# EAGLE design PoE_Mag-revD (EAGLE 8.6.0)
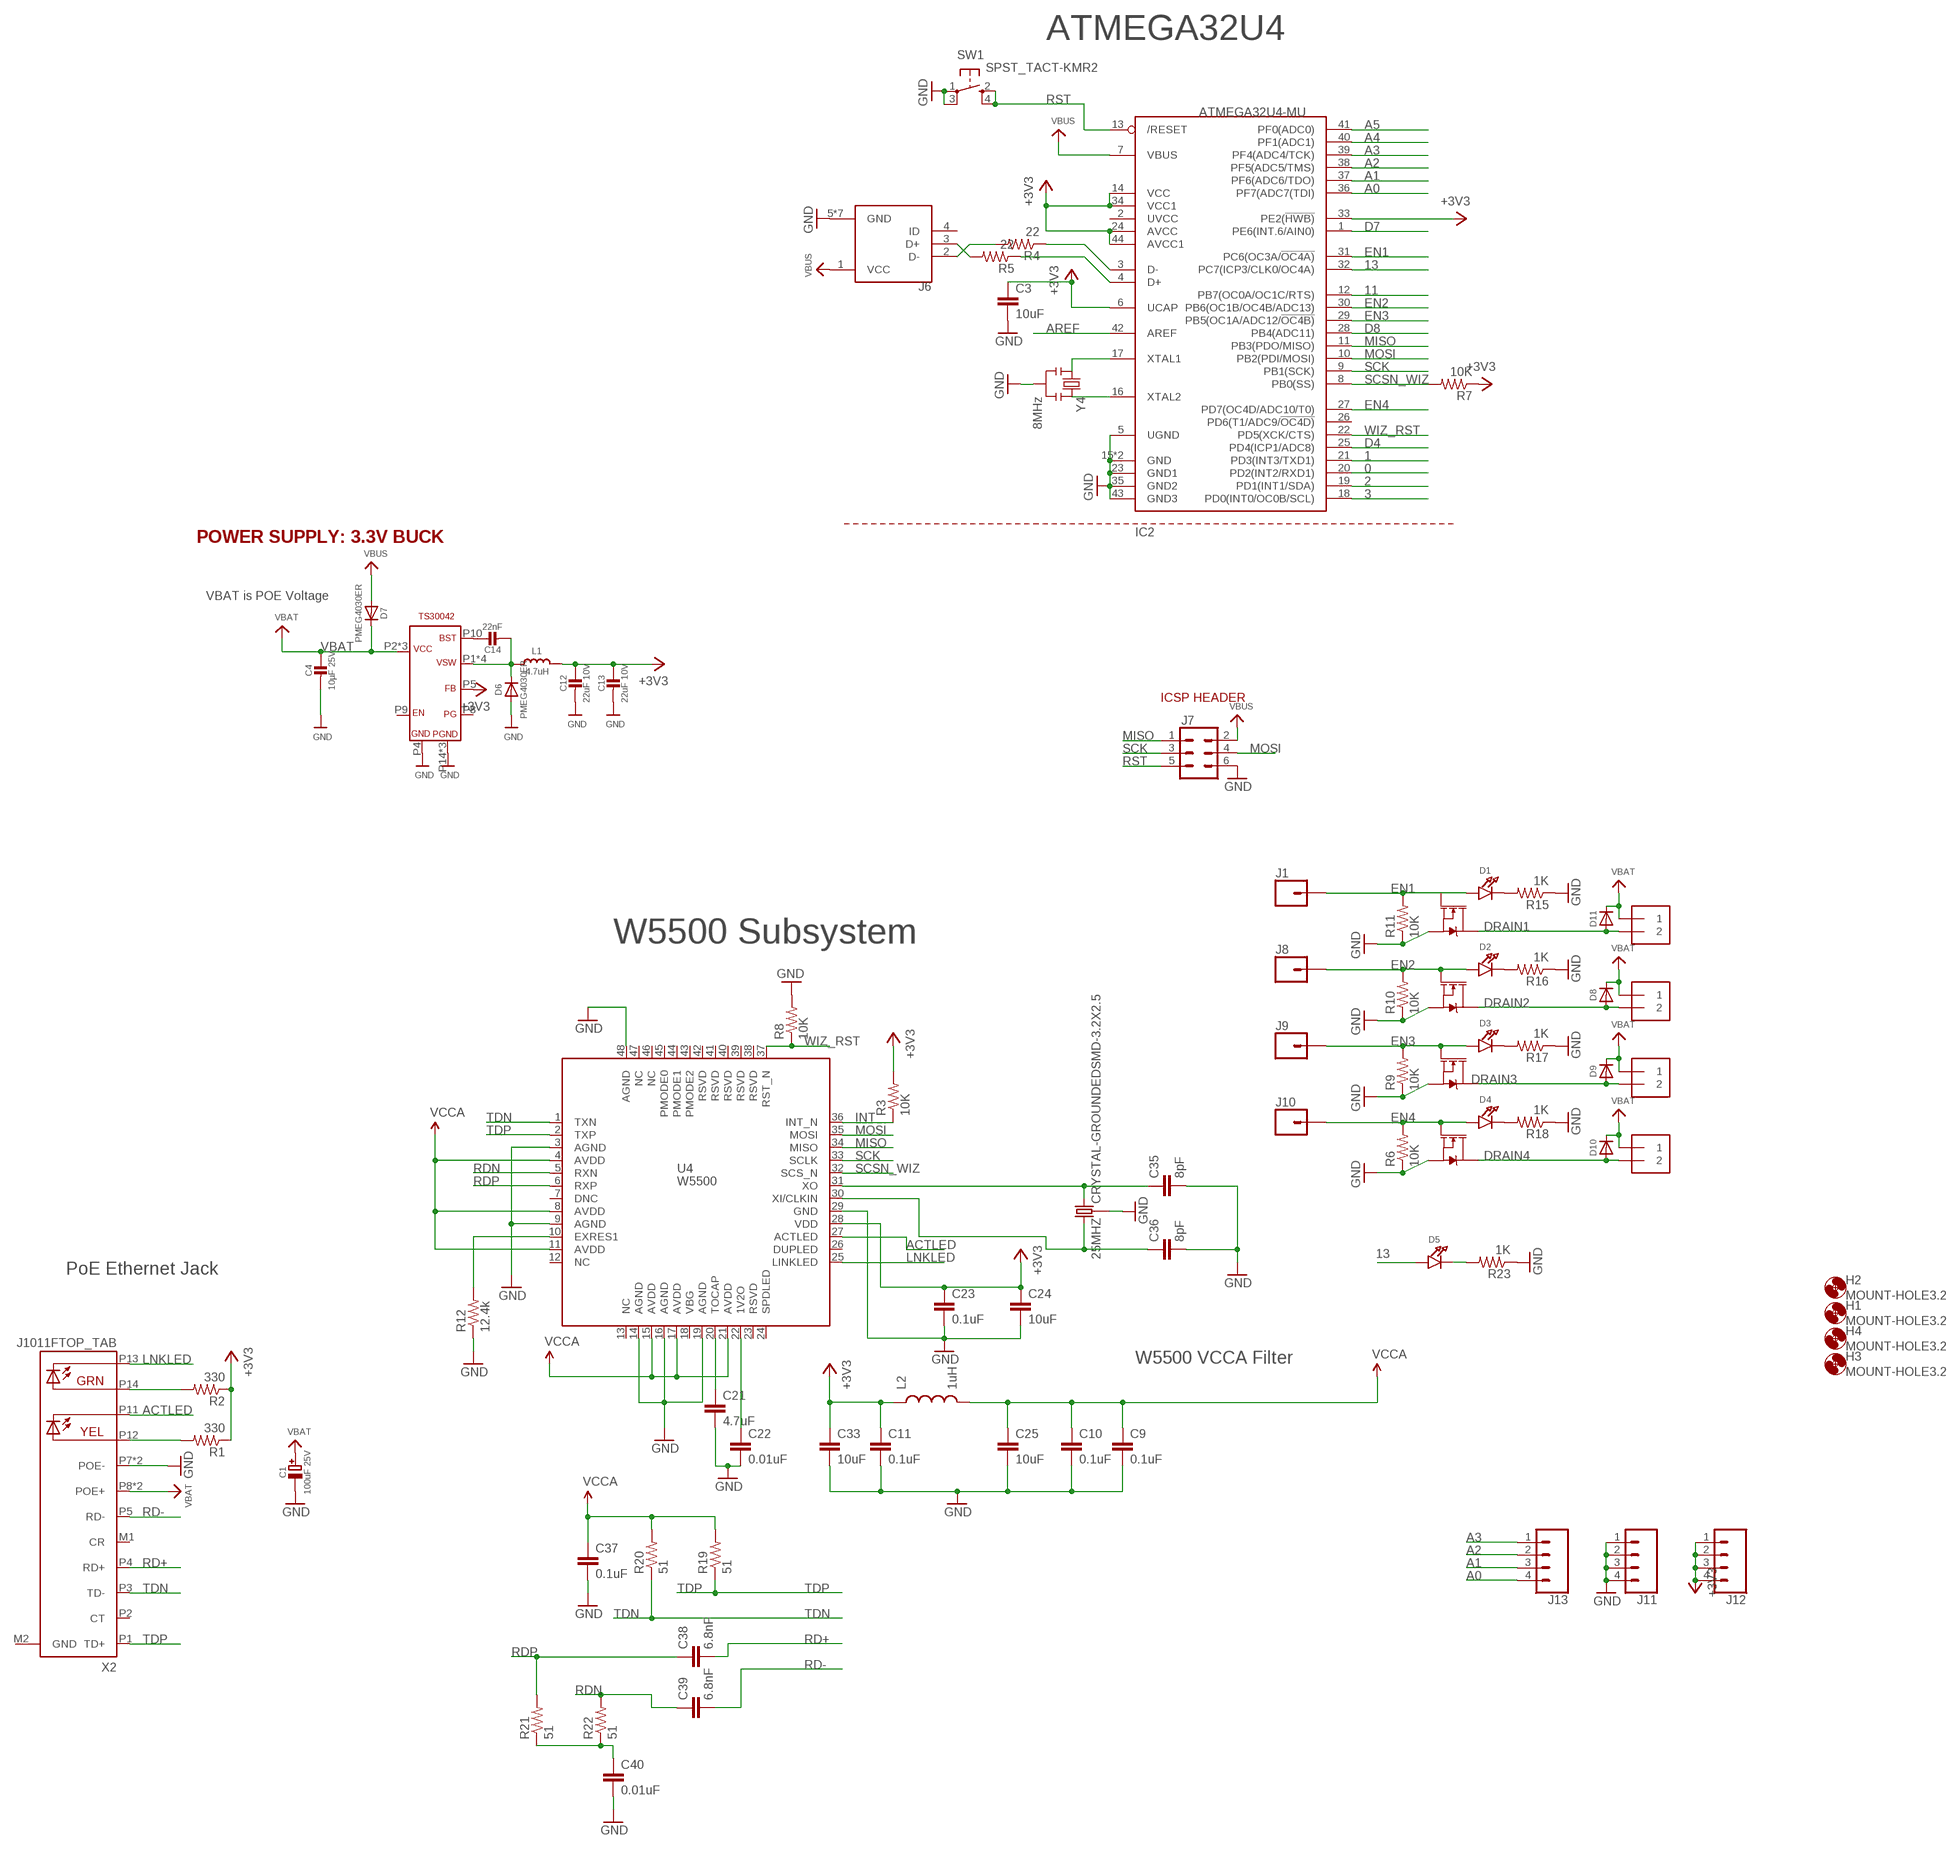
[diagram p0: schematic, sheet 1]

## Parts
25MHZ  CRYSTAL-GROUNDEDSMD-3.2X2.5  [CRYSTAL-SMD-3.2X2.5MM]
C1  100uF 25V  CAP_ELECTROLYTICPANASONIC_D  [PANASONIC_D]
C3  10uF  CAP0603-CAP  [0603-CAP]
C4  10µF 25V  CAP_CERAMIC0603MINI  [0603-MINI]
C9  0.1uF  CAP0603-CAP  [0603-CAP]
C10  0.1uF  CAP0603-CAP  [0603-CAP]
C11  0.1uF  CAP0603-CAP  [0603-CAP]
C12  22uF 10V  CAP_CERAMIC0603MINI  [0603-MINI]
C13  22uF 10V  CAP_CERAMIC0603MINI  [0603-MINI]
C14  22nF  CAP_CERAMIC0603MINI  [0603-MINI]
C21  4.7uF  CAP0603-CAP  [0603-CAP]
C22  0.01uF  CAP0603-CAP  [0603-CAP]
C23  0.1uF  CAP0603-CAP  [0603-CAP]
C24  10uF  CAP0603-CAP  [0603-CAP]
C25  10uF  CAP0603-CAP  [0603-CAP]
C33  10uF  CAP0603-CAP  [0603-CAP]
C35  8pF  CAP0603-CAP  [0603-CAP]
C36  8pF  CAP0603-CAP  [0603-CAP]
C37  0.1uF  CAP0603-CAP  [0603-CAP]
C38  6.8nF  CAP0603-CAP  [0603-CAP]
C39  6.8nF  CAP0603-CAP  [0603-CAP]
C40  0.01uF  CAP0603-CAP  [0603-CAP]
D1  LED0805_NOOUTLINE  [CHIPLED_0805_NOOUTLINE]
D2  LED0805_NOOUTLINE  [CHIPLED_0805_NOOUTLINE]
D3  LED0805_NOOUTLINE  [CHIPLED_0805_NOOUTLINE]
D4  LED0805_NOOUTLINE  [CHIPLED_0805_NOOUTLINE]
D5  LED0805_NOOUTLINE  [CHIPLED_0805_NOOUTLINE]
D6  PMEG4030ER  DIODESOD-123  [SOD-123]
D7  PMEG4030ER  DIODESOD-123  [SOD-123]
D8  DIODESOD-123  [SOD-123]
D9  DIODESOD-123  [SOD-123]
D10  DIODESOD-123  [SOD-123]
D11  DIODESOD-123  [SOD-123]
H1  MOUNT-HOLE3.2  [3,2]
H2  MOUNT-HOLE3.2  [3,2]
H3  MOUNT-HOLE3.2  [3,2]
H4  MOUNT-HOLE3.2  [3,2]
IC2  ATMEGA32U4-MU  [TQFN44_7MM]
J1  CONN_01  [1X01]
J2  1X2-3.5MM  [1X2-3.5MM]
J3  1X2-3.5MM  [1X2-3.5MM]
J4  1X2-3.5MM  [1X2-3.5MM]
J5  1X2-3.5MM  [1X2-3.5MM]
J6  10103594-0001LF  [FCI_10103594-0001LF]
J7  CONN_03X2NO_SILK  [2X3-NS]
J8  CONN_01  [1X01]
J9  CONN_01  [1X01]
J10  CONN_01  [1X01]
J11  CONN_04  [1X04]
J12  CONN_04  [1X04]
J13  CONN_041X04_NO_SILK  [1X04_NO_SILK]
L1  4.7uH  INDUCTORTDK_VLC5045  [INDUCTOR_5X5MM_TDK_VLC5045]
L2  1uH  INDUCTOR0603  [0603]
Q1  35A/25V/8.5mΩ  MOSFET-NCH-FDD8780  [DPAK]
Q3  35A/25V/8.5mΩ  MOSFET-NCH-FDD8780  [DPAK]
Q5  35A/25V/8.5mΩ  MOSFET-NCH-FDD8780  [DPAK]
Q6  35A/25V/8.5mΩ  MOSFET-NCH-FDD8780  [DPAK]
R1  330  RESISTOR0603-RES  [0603-RES]
R2  330  RESISTOR0603-RES  [0603-RES]
R3  10K  RESISTOR0603-RES  [0603-RES]
R4  22  RESISTOR0603-RES  [0603-RES]
R5  22  RESISTOR0603-RES  [0603-RES]
R6  10K  RESISTOR0603-RES  [0603-RES]
R7  10K  RESISTOR0603-RES  [0603-RES]
R8  10K  RESISTOR0603-RES  [0603-RES]
R9  10K  RESISTOR0603-RES  [0603-RES]
R10  10K  RESISTOR0603-RES  [0603-RES]
R11  10K  RESISTOR0603-RES  [0603-RES]
R12  12.4k  RESISTOR0603-RES  [0603-RES]
R15  1K  RESISTOR0603-RES  [0603-RES]
R16  1K  RESISTOR0603-RES  [0603-RES]
R17  1K  RESISTOR0603-RES  [0603-RES]
R18  1K  RESISTOR0603-RES  [0603-RES]
R19  51  RESISTOR0603-RES  [0603-RES]
R20  51  RESISTOR0603-RES  [0603-RES]
R21  51  RESISTOR0603-RES  [0603-RES]
R22  51  RESISTOR0603-RES  [0603-RES]
R23  1K  RESISTOR0603-RES  [0603-RES]
SW1  SPST_TACT-KMR2  [KMR2]
U4  W5500  [W5500]
U$19  BUCK_CONVERTER  [QFN-16]
X2  J1011FTOP_TAB  [HANRUN_HR971169C]
Y4  8MHz  RESONATORSMD  [RESONATOR-SMD]

## Nets
0: IC2.20(PD2(INT2/RXD1))
1: IC2.21(PD3(INT3/TXD1))
2: IC2.19(PD1(INT1/SDA))
3: IC2.18(PD0(INT0/OC0B/SCL))
11: IC2.12(PB7(OC0A/OC1C/RTS))
13: D5.A IC2.32(PC7(ICP3/CLK0/OC4A))
+3V3: C3.1 C11.1 C12.1 C13.1 C23.1 C24.1 C33.1 IC2.6(UCAP) IC2.14(VCC) IC2.24(AVCC) IC2.33(PE2(!HWB)) IC2.34(VCC1) IC2.44(AVCC1) J12.1 J12.2 J12.3 J12.4 L1.P$2 L2.1 R1.1 R2.1 R3.2 R7.1 U4.28(VDD) U$19.P5(FB)
A0: IC2.36(PF7(ADC7(TDI)) J13.4
A1: IC2.37(PF6(ADC6/TDO)) J13.3
A2: IC2.38(PF5(ADC5/TMS)) J13.2
A3: IC2.39(PF4(ADC4/TCK)) J13.1
A4: IC2.40(PF1(ADC1))
A5: IC2.41(PF0(ADC0))
ACTLED: U4.27(ACTLED) X2.P11(YEL-C)
AREF: IC2.42(AREF)
D4: IC2.25(PD4(ICP1/ADC8))
D7: IC2.1(PE6(INT.6/AIN0))
D8: IC2.28(PB4(ADC11))
D+: IC2.4(D+) R5.1
D-: IC2.3(D-) R4.1
DRAIN1: D11.A J2.2 Q1.4(D)
DRAIN2: D8.A J3.2 Q3.4(D)
DRAIN3: D9.A J4.2 Q5.4(D)
DRAIN4: D10.A J5.2 Q6.4(D)
EN1: D1.A IC2.31(PC6(OC3A/!OC4A)) J1.1 Q1.1(G) R11.2
EN2: D2.A IC2.30(PB6(OC1B/OC4B/ADC13)) J8.1 Q3.1(G) R10.2
EN3: D3.A IC2.29(PB5(OC1A/ADC12/!OC4B)) J9.1 Q5.1(G) R9.2
EN4: D4.A IC2.27(PD7(OC4D/ADC10/T0)) J10.1 Q6.1(G) R6.2
GND: 25MHZ.2 25MHZ.4 C1.- C3.2 C4.2 C9.2 C10.2 C11.2 C12.2 C13.2 C21.2 C22.2 C23.2 C24.2 C25.2 C33.2 C35.2 C36.2 C37.2 C40.2 D6.A IC2.5(UGND) IC2.15(GND) IC2.23(GND1) IC2.35(GND2) IC2.43(GND3) IC2.THERMAL(GND) J6.5(GND) J6.P1(GND) J6.P2(GND) J6.P3(GND) J6.P4(GND) J6.P5(GND) J6.P6(GND) J7.6 J11.1 J11.2 J11.3 J11.4 Q1.3(S) Q3.3(S) Q5.3(S) Q6.3(S) R6.1 R8.2 R9.1 R10.1 R11.1 R12.1 R15.1 R16.1 R17.1 R18.1 R23.1 SW1.1(P) SW1.3(P1) U4.3(AGND) U4.9(AGND) U4.14(AGND) U4.16(AGND) U4.19(AGND) U4.29(GND) U4.48(AGND) U$19.P4(GND) U$19.P14(PGND) U$19.P15(PGND) U$19.PAD(PGND) X2.P7(POE-) X2.P9(POE-) Y4.2
INT: R3.1 U4.36(INT_N)
LNKLED: U4.25(LINKLED) X2.P13(GRN-C)
MISO: IC2.11(PB3(PDO/MISO)) J7.1 U4.34(MISO)
MOSI: IC2.10(PB2(PDI/MOSI)) J7.4 U4.35(MOSI)
N$3: R2.2 X2.P14(GRN-A)
N$4: R1.2 X2.P12(YEL-A)
N$5: D1.C R15.2
N$6: J6.3(D+) R5.2
N$7: D2.C R16.2
N$8: D3.C R17.2
N$9: D4.C R18.2
N$10: D5.C R23.2
N$11: IC2.16(XTAL2) Y4.3
N$12: IC2.17(XTAL1) Y4.1
N$13: J6.2(D-) R4.2
N$14: C14.1 U$19.P10(BST)
N$16: C14.2 D6.C L1.P$1 U$19.P1(VSW) U$19.P12(VSW) U$19.P13(VSW) U$19.P16(VSW)
N$18: C21.1 U4.20(TOCAP)
N$19: C22.1 U4.22(1V2O)
N$20: R12.2 U4.10(EXRES1)
N$23: C40.1 R21.1 R22.1
N$25: 25MHZ.3 C35.1 U4.31(XO)
N$26: 25MHZ.1 C36.1 U4.30(XI/CLKIN)
RD+: C38.2 X2.P4(RD+)
RD-: C39.2 X2.P5(RD-)
RDN: C39.1 R22.2 U4.5(RXN)
RDP: C38.1 R21.2 U4.6(RXP)
RST: IC2.13(/RESET) J7.5 SW1.2(S) SW1.4(S1)
SCK: IC2.9(PB1(SCK)) J7.3 U4.33(SCLK)
SCSN_WIZ: IC2.8(PB0(SS)) R7.2 U4.32(SCS_N)
TDN: R20.1 U4.1(TXN) X2.P3(TD-)
TDP: R19.1 U4.2(TXP) X2.P1(TD+)
VBAT: C1.+ C4.1 D7.C D8.C D9.C D10.C D11.C J2.1 J3.1 J4.1 J5.1 U$19.P2(VCC) U$19.P3(VCC) U$19.P11(VCC) X2.P8(POE+) X2.P10(POE+)
VBUS: D7.A IC2.7(VBUS) J6.1(VCC) J7.2
VCCA: C9.1 C10.1 C25.1 C37.1 L2.2 R19.2 R20.2 U4.4(AVDD) U4.8(AVDD) U4.11(AVDD) U4.15(AVDD) U4.17(AVDD) U4.21(AVDD)
WIZ_RST: IC2.22(PD5(XCK/CTS)) R8.1 U4.37(RST_N)
Unconnected: IC2.2(UVCC) IC2.26(PD6(T1/ADC9/!OC4D)) J6.4(ID) U4.7(DNC) U4.12(NC) U4.13(NC) U4.18(VBG) U4.23(RSVD) U4.24(SPDLED) U4.26(DUPLED) U4.38(RSVD) U4.39(RSVD) U4.40(RSVD) U4.41(RSVD) U4.42(RSVD) U4.43(PMODE2) U4.44(PMODE1) U4.45(PMODE0) U4.46(NC) U4.47(NC) U$19.P8(PG) U$19.P9(EN) X2.M1(CR) X2.P2(CT)

## Notes on the sheet
- ATMEGA32U4
- POWER SUPPLY: 3.3V BUCK
- VBAT is POE Voltage
- ICSP HEADER
- W5500 Subsystem
- PoE Ethernet Jack
- W5500 VCCA Filter

## Power pins joined to a net without a drawn wire
GND: X2.M2(GND)

## Library data of the parts
25MHZ = SparkFun-Clocks:CRYSTAL-GROUNDED: Crystals w/ Ground Pin (Generic) These are passive quartz crystals, which can be used as a clock source for a microcontroller. Crystal's are usually two-terminal devices. A third terminal may be optionally connected to ground, as recommended by the manufaturer.
C1 = microbuilder:CAP_ELECTROLYTIC: Electrolytic Capacitors SMT PANASONIC_C - Size C Panasonic Electrolytic Aluminum Capacitor 47µF 16V 20% Electrolytic Capacitor [Digikey: PCE3890TR-ND] PANASONIC_D - Size D Panasonic Electrolytic Aluminum Capacitor 100µF 25V 20% Electrolytic Capacitor [Digikey: PCE3898TR-ND] PTH 3.5 mm grid, 8 mm diameter ... 3.5 mm grid, 10 mm diameter ...
C3 C9-C11 C21-C25 C33 C35-C40 = SparkFun-Passives:CAP: Capacitor Standard 0603 ceramic capacitor, and 0.1" leaded capacitor.
C4 C12-C14 = microbuilder:CAP_CERAMIC: Ceramic Capacitors For new designs, use the packages preceded by an '_' character since they are more reliable: The following footprints should be used on most boards: _0402 - Standard footprint for regular board layouts _0603 - Standard footprint for regular board layouts _0805 - Standard footprint for regular board layouts _1206 - Standard footprint for regular board layouts For extremely tight-pitch boards where space is at a premium, the following 'micro-pitch' footprints can be used (smaller pads, no silkscreen outline, etc.): _0402MP - Micro-pitch footprint for very dense/compact boards _0603MP - Micro-pitch footprint for very dense/compact boards _0805MP - Micro-pitch footprint for very dense/compact boards _1206MP - Micro-pitch footprint for very dense/compact boards
D1-D5 = microbuilder:LED: LED 0603 - 0603 Surface Mount Package 2mA: Green LED - Low Power (3.9mcd, 2ma, 1.7Vf) - Digikey: 475-2709-2-ND Orange LED - Low Power (9.8mcd, 2ma, 1.8Vf) - Digikey: 475-1194-2-ND Red LED - Low Power (5mcd, 2ma, 1.8Vf) - Digikey: 475-1195-2-ND Yellow LED - Low Power (7mcd, 2ma, 1.8Vf) - Digikey: 475-1196-2-ND 5mA: Blue LED - Low Power (17mcd, 5ma, 2.9Vf) - Digikey: LNJ937W8CRACT-ND 0805 - 0805 Surface Mount Package 2mA: Red LED (8.8mcd, 2mA, 1.8Vf, Clear) - Low Power [Digikey: 475-2510-1-ND] Green LED (5mcd, 2mA, 1.8Vf, Clear) - Low Power [Digikey: 475-2730-1-ND] Yellow LED (11.3mcd, 2mA, 1.8Vf, Clear) - Low Power [Digikey: 475-2555-1-ND] 20mA: Red LED (104mcd, 20mA, Diffused) - LS R976 [Digikey: 475-1278-6-ND] Red LED (12mcd, 20mA, 2.0Vf, Clear) - APT2012EC [Digikey: 754-1128-1-ND] Green LED (15mcd, 20mA, 2.2Vf, Clear) - APT2012GC [Digikey: 754-1131-1-ND] Orange LED (160mcd, 20mA, 2.1Vf, Clear) - APT2012SECK [Digikey: 754-1130-1-ND] 1206 - 1206 Surface Mount Package Green LED (26mcd, 20mA, Diffused) - LG N971 [Digikey: 475-1407-6-ND] Red LED (15mcd, 20mA, Diffused) - LH N974 [Digikey: 475-1416-6-ND] Cree - Cree High-Power Surface Mount LEDs XPEBWT-L1-0000-00D50 - White 111lm 350mA 2.9Vf 6200K 110° XTEAWT-00-0000-00000LEE3 - White 114lm 350mA 2.85Vf 5000K 115° Everlight - Everlight 45-21 Series Surface Mount LEDs 45-21/QK2C-B2832AC2CB2/2T - Warm White 2000mcd 20mA 3.25Vf 3050K 120° 45-21/LK2C-B38452C4CB2/2T - Nuetral White 2000mcd 20mA 3.25Vf 4150K 120° 45-21/LK2C-B50634C6CB2/2T - Cold White 2200mcd 20mA 3.25Vf 5650K 120° PLCC2 Reverse Mount LS T77K-J1L2-1-0-2-R18-Z - Red 11.25mcd 2mA 1.8Vf 630nm 120° LO T77K-L1M2-24-Z - Orange 19.6mcd 2mA 1.8Vf 606nm 120° LY T77K-K2M1-26-Z - Yellow 15.7mcd 2mA 1.8Vf 587nm 120°
D6-D11 = microbuilder:DIODE: Diode SMA Model Volts Amps Type Vf Ir Digikey # Notes SSA34-E3 40V 3A Schottky 480mV @ 3A 200uA @ 40V SSA34-E3/61TGITR-ND CDBA120-G 20V 1A Schottky 500mV @ 1A 500uA @ 20V 641-1014-6-ND REEL MBRA210 10V 2A Schottky 350mV @ 2A 700uA @ 10V MBRA210LT3 SOD-123 Model Volts Amps Type Vf Ir Order # Notes BAT54T1G 30V 200mA Schottky 800mV @ 200mA 2uA @ 25V BAT54T1GOSTR-ND B0530W 30V 500mA Schottky 430mV @ 500mA 130uA @ 30V B0530W-FDICT-ND REEL MBR120 20V 1A Schottky 340mV @ 1A MBR120VLSFT1GOSCT-ND SOD-323 Model Volts Amps Type Vf Ir Order # Notes PMEG2005EJ 20V 500mA Schottky 355mV @ 500mA 568-4110-1-ND ZLLS410 10V 570mA Schottky 380mV @ 570mA ZLLS410CT-ND 1N4148WS 75V 150mA Silicon/Simple 1V 1N4148WSFSCT-ND REEL SOD-523 Model Volts Amps Type Vf Ir Order # Notes BAT54XV2 30V 200mA Schottky 0.8V @ 100mA BAT54XV2CT-ND TB751S 30V 30mA Schottky RB751S-40TE61CT-ND SOT23-R/W (R = Solder Paste/Reflow Ovens, W = Hand-Soldering) Model Volts Amps Type Vf Ir Order # Notes BAT54FILM 40V 300mA Schottky 497-7162-1-ND POWERDI-5 Model Volts Amps Type Vf Ir Order # Notes PDS560 60V 5A Schottky 670mV @ 5A 150uA @ 60V PDS560DICT-ND
H1-H4 = holes:MOUNT-HOLE: MOUNTING HOLE with drill center marker
IC2 = microbuilder:ATMEGA32U4: http://www.ladyada.net/library/eagle
J1 J8-J10 = SparkFun-Connectors:CONN_01: Single connection point. Often used as Generic Header-pin footprint for 0.1 inch spaced/style header connections On any of the 0.1 inch spaced packages, you can populate with these: Break Away Headers - Straight <https://www.sparkfun.com/products/116> (PRT-00116) Break Away Male Headers - Right Angle <https://www.sparkfun.com/products/553> (PRT-00553) Female Headers <https://www.sparkfun.com/products/115> (PRT-00115) Break Away Headers - Machine Pin <https://www.sparkfun.com/products/117> (PRT-00117) Break Away Female Headers - Swiss Machine Pin <https://www.sparkfun.com/products/743> (PRT-00743) This device is also useful as a general connection point to wire up your design to another part of your project. Our various solder wires solder well into these plated through hole pads. Hook-Up Wire - Assortment (Stranded, 22 AWG) <https://www.sparkfun.com/products/11375> (PRT-11375) Hook-Up Wire - Assortment (Solid Core, 22 AWG) <https://www.sparkfun.com/products/11367> (PRT-11367) View the entire wire category on our website here <https://www.sparkfun.com/categories/141> Special notes: SMTSO-256-ET is a "flush mount" nut for a 4-40 screw. We mostly use this on specialty testbeds; it is a nice way to connect hardware to your PCB at an adjustable hieght. Also note, the SNAP packages are for using a snappable style connector. We sell a baggie of snaps and they are also used on two LilyPad designs: Snap Assortment - 30 pack (male and female) <https://www.sparkfun.com/products/11347> (DEV-11347) LilyPad Arduino SimpleSnap <https://www.sparkfun.com/products/10941> (DEV-10941) LilyPad SimpleSnap Protoboard <https://www.sparkfun.com/products/10940> (DEV-10940)
J2-J5 = adafruit:1X2: 3.5mm Terminal block http://www.ladyada.net/library/pcb/eaglelibrary.html
J6 = 10103594-0001LF:10103594-0001LF: Conn Micro USB Type B RCP 5 POS 0.65mm Solder RA SMD 5 Terminal 1 Port T/R; AVAILABILITY: Good; DESCRIPTION: Conn Micro USB Type B RCP 5 POS 0.65mm Solder RA SMD 5 Terminal 1 Port T/R; MF: FCI; MP: 10103594-0001LF; PACKAGE: None; PRICE: 0.40 USD
J7 = SparkFun-Connectors:CONN_03X2: Multi connection point. Often used as Generic Header-pin footprint for 0.1 inch spaced/style header connections You can populate with any combo of single row headers, but if you'd like an exact match, check these: Header - 2x3 (Male, 0.1") <https://www.sparkfun.com/products/12807> (PRT-12807) Header - 2x3 (Female, 0.1") <https://www.sparkfun.com/products/13010> (PRT-13010) 2x3 Pin Shrouded Header <https://www.sparkfun.com/products/10877> (PRT-10877) On any of the 0.1 inch spaced packages, you can populate with these: Break Away Headers - Straight <https://www.sparkfun.com/products/116> (PRT-00116) Break Away Male Headers - Right Angle <https://www.sparkfun.com/products/553> (PRT-00553) Female Headers <https://www.sparkfun.com/products/115> (PRT-00115) Break Away Headers - Machine Pin <https://www.sparkfun.com/products/117> (PRT-00117) Break Away Female Headers - Swiss Machine Pin <https://www.sparkfun.com/products/743> (PRT-00743) Special note: the shrouded connector mates well with our 3x2 ribbon cables: Ribbon Crimp Connector - 6-pin (2x3, Female) <https://www.sparkfun.com/products/10651> (PRT-10651) Ribbon Cable - 6 wire (15ft) <https://www.sparkfun.com/products/10646> (PRT-10646)
J11-J13 = SparkFun-Connectors:CONN_04: Multi connection point. Often used as Generic Header-pin footprint for 0.1 inch spaced/style header connections On any of the 0.1 inch spaced packages, you can populate with these: Break Away Headers - Straight <https://www.sparkfun.com/products/116> (PRT-00116) Break Away Male Headers - Right Angle <https://www.sparkfun.com/products/553> (PRT-00553) Female Headers <https://www.sparkfun.com/products/115> (PRT-00115) Break Away Headers - Machine Pin <https://www.sparkfun.com/products/117> (PRT-00117) Break Away Female Headers - Swiss Machine Pin <https://www.sparkfun.com/products/743> (PRT-00743) For SCREWTERMINALS and SPRING TERMINALS visit here: Screw Terimnals on SparkFun.com <https://www.sparkfun.com/search/results?term=Screw+Terminals> (5mm/3.5mm/2.54mm spacing) This device is also useful as a general connection point to wire up your design to another part of your project. Our various solder wires solder well into these plated through hole pads. Hook-Up Wire - Assortment (Stranded, 22 AWG) <https://www.sparkfun.com/products/11375> (PRT-11375) Hook-Up Wire - Assortment (Solid Core, 22 AWG) <https://www.sparkfun.com/products/11367> (PRT-11367) View the entire wire category on our website here <https://www.sparkfun.com/categories/141> Special notes: Molex polarized connector foot print use with SKU : PRT-08231 with associated crimp pins and housings. 1MM SMD Version SKU: PRT-10208; PROD_ID: CONN-09696
L1 = microbuilder:INDUCTOR: Inductors
L2 = SparkFun-Passives:INDUCTOR: Inductors
Q1 Q3 Q5 Q6 = SparkFun-DiscreteSemi:MOSFET-NCH: N-channel MOSFETs Voltage controlled devices that allow control of high current outputs. SparkFun Products: SparkFun OpenScale <https://www.sparkfun.com/products/13261> SparkFun Digital Sandbox <https://www.sparkfun.com/products/12651> SparkFun Monster Moto Shield <https://www.sparkfun.com/products/10182> SparkFun MOSFET Power Controller <https://www.sparkfun.com/products/11214>; PROD_ID: TRANS-09984
R1-R12 R15-R23 = SparkFun-Passives:RESISTOR: Resistor Basic schematic elements and footprints for 0603, 1206, and PTH resistors.
SW1 = adafruit:SPST_TACT: SMT 6mm switch, EVQQ2 series http://www.ladyada.net/library/eagle
U4 = W5500:W5500
U$19 = Heep:BUCK_CONVERTER
X2 = Heep:J1011F: PULSEJACK (TM) 1x1 Tab-UP RJ45 10/100 Base-TX RJ45 1x1 Tab-UP with LEDs 8-pin (J1 series) and 6-pin (JP series) integrated magnetics connector, designed to support applications, such as ADSL modems, LAN-on-Motherboard, and Hub and Switches. Source: www.pulseeng.com .. PulseJack-J402.pdf
Y4 = SparkFun:RESONATOR: Resonator Small SMD resonator. This is the itty bitty 10/20MHz resonators with built in caps. CSTCE10M0G55 and CSTCE20M0V53. Footprint has been reviewed closely but hasn't been tested yet.

## Net classes
3 usbvcc: width 0.305 mm, drill 0.483 mm, clearance 0.203 mm

## Board
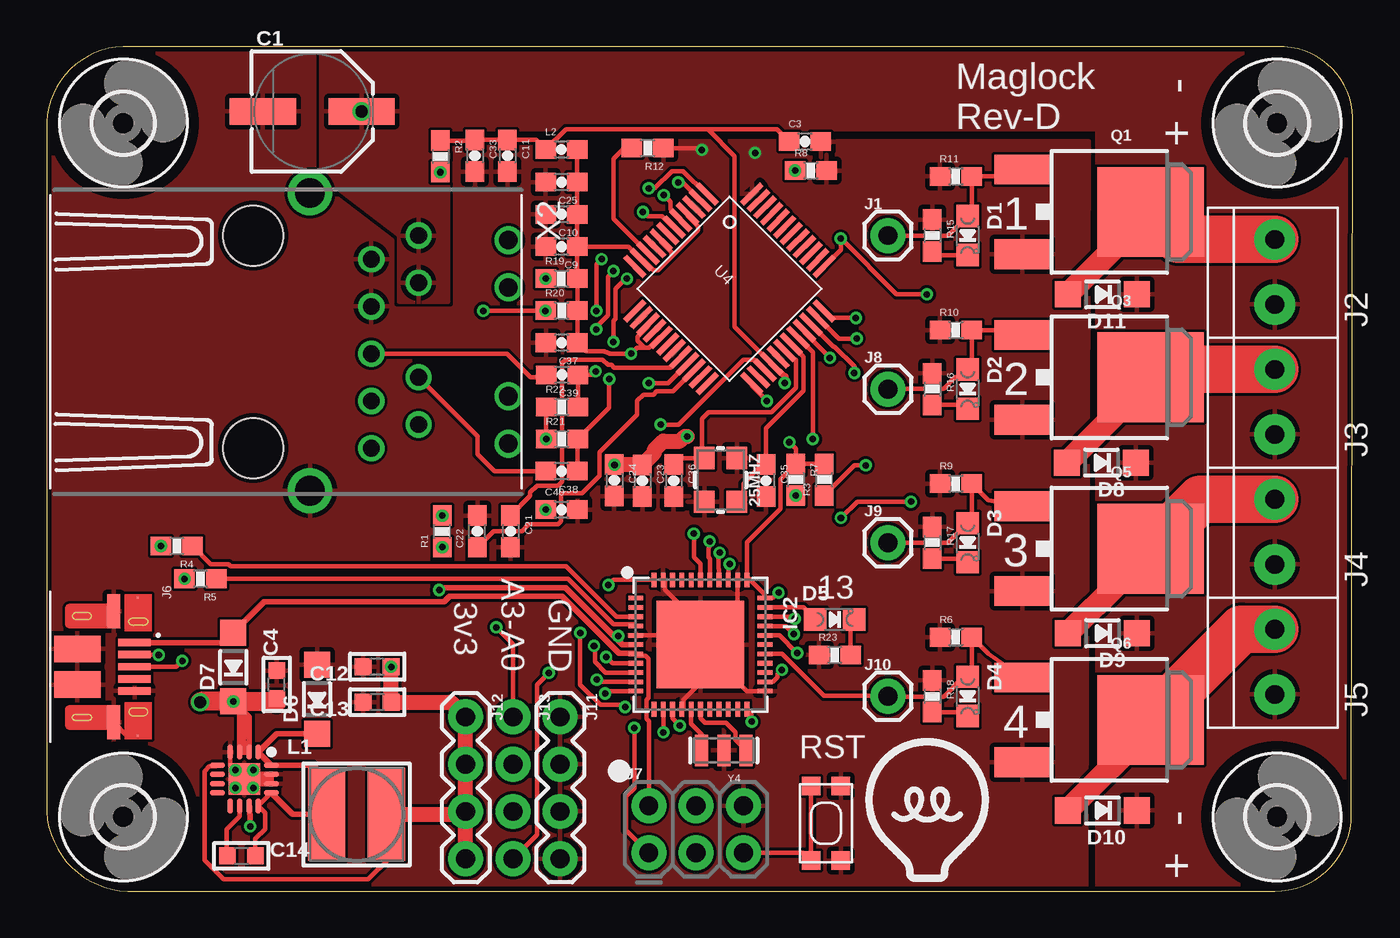
[diagram p1: board, top side]
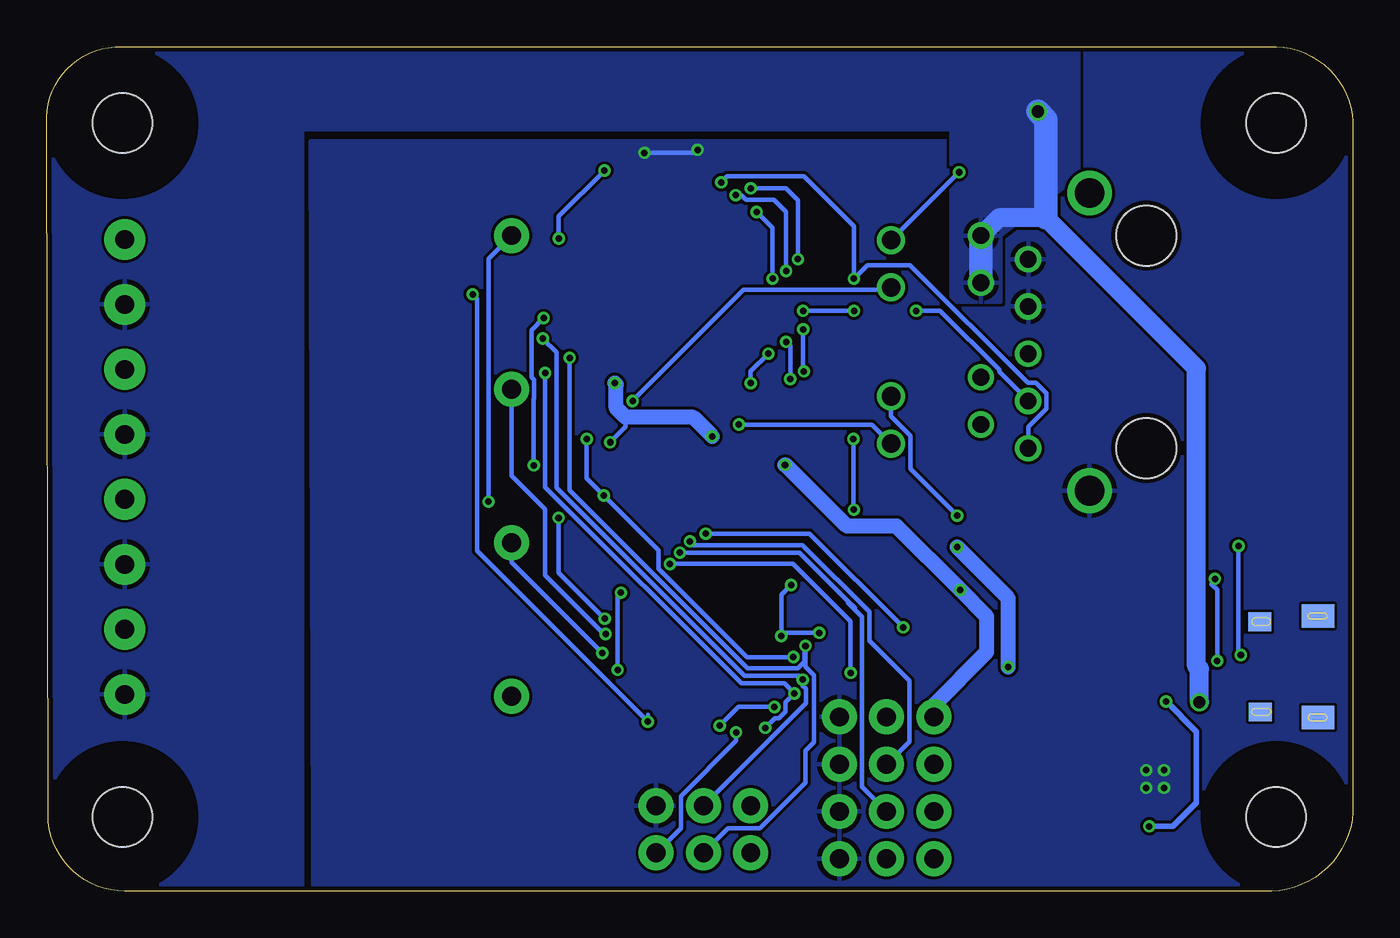
[diagram p2: board, bottom side, seen from below]

Size 70.25 x 45.4 mm. Coordinates in mm from the lower left corner, seen from the top.
Outline: 4.37,0 66.04,0 arc90 70.17,4.13 70.25,41.59 arc90 66.2,45.39 4.13,45.4 arc90 0,40.96 0,4.68 arc90 4.37,0
Copper layers (1*16): Top 0.035mm / dielectric 1.5mm / Bottom 0.035mm
Design rules "SeeedStudio_2layer_DRU_no_angle_20140221": minimum track width 6mil, minimum drill 12mil, track to track 6mil, track to pad 6mil, pad to pad 6mil, via to via 6mil, smd to smd 0mil, copper to edge 10mil, drill to drill 10mil, minimum pad ring 10mil, minimum via ring 6mil, stop-mask expansion 2mil, vias tented up to drill 100mil, thermal gap 10mil

### Footprints (pad centres in the part's own frame; a part is rotated, then mirrored left to right if it is on the bottom)
CRYSTAL-SMD-3.2X2.5MM = smd 1.2 x 1.1: 1 -1.175,-0.875; 2 1.175,-0.875; 3 1.175,0.875; 4 -1.175,0.875
PANASONIC_D = smd 3.556 x 1.4: + 2.654,0; - -2.654,0
0603-CAP = smd 1.1 x 1: 1 -0.85,0; 2 0.85,0
0603-MINI = smd 0.9 x 0.9: 1 -0.75,0; 2 0.75,0
CHIPLED_0805_NOOUTLINE = smd 1.2 x 1.2: A 0,-1.05; C 0,1.05
SOD-123 = smd 1.4 x 1.4: A 1.85,0; C -1.85,0
3,2 = hole 3.2: 0,0
TQFN44_7MM = smd 0.25 x 0.8: 1 -2.5,-3.475; 2 -2,-3.475; 3 -1.5,-3.475; 4 -1,-3.475; 5 -0.5,-3.475; 6 0,-3.475; 7 0.5,-3.475; 8 1,-3.475; 9 1.5,-3.475; 10 2,-3.475; 11 2.5,-3.475; 23 2.5,3.475; 24 2,3.475; 25 1.5,3.475; 26 1,3.475; 27 0.5,3.475; 28 0,3.475; 29 -0.5,3.475; 30 -1,3.475; 31 -1.5,3.475; 32 -2,3.475; 33 -2.5,3.475 | smd 0.8 x 0.25: 12 3.475,-2.5; 13 3.475,-2; 14 3.475,-1.5; 15 3.475,-1; 16 3.475,-0.5; 17 3.475,0; 18 3.475,0.5; 19 3.475,1; 20 3.475,1.5; 21 3.475,2; 22 3.475,2.5; 34 -3.475,2.5; 35 -3.475,2; 36 -3.475,1.5; 37 -3.475,1; 38 -3.475,0.5; 39 -3.475,0; 40 -3.475,-0.5; 41 -3.475,-1; 42 -3.475,-1.5; 43 -3.475,-2; 44 -3.475,-2.5 | smd 4.7 x 4.7: THERMAL 0,0
1X01 = drill 1.016 pad 1.88: 1 0,0
1X2-3.5MM = drill 1 pad 2.184: 1 1.8,0; 2 -1.7,0
FCI_10103594-0001LF = smd 0.4 x 1.75: 1 -1.3,2.825; 2 -0.65,2.825; 3 0,2.825; 4 0.65,2.825; 5 1.3,2.825 | smd 0.1 x 0.1: P1 -3.7,3; P2 3.7,3 | smd 1.825 x 0.7: P3 -2.987,1.7; P4 2.987,1.7 | smd 1.425 x 2.5: P5 -0.963,-0.25; P6 0.963,-0.25 | smd 1.25 x 1.75 bottom: P$1 -2.731,-0.026; P$2 2.726,-0.018 | smd 1 x 1.25 bottom: P$3 -2.422,3.111; P$4 2.427,3.078
2X3-NS = drill 1.016 pad 1.88: 1 -2.54,-1.27; 2 -2.54,1.27; 3 0,-1.27; 4 0,1.27; 5 2.54,-1.27; 6 2.54,1.27
1X04 = drill 1.016 pad 1.88: 1 0,0; 2 2.54,0; 3 5.08,0; 4 7.62,0
1X04_NO_SILK = drill 1.016 pad 1.88: 1 0,0; 2 2.54,0; 3 5.08,0; 4 7.62,0
INDUCTOR_5X5MM_TDK_VLC5045 = smd 2 x 5: P$1 -1.6,0; P$2 1.6,0
0603 = smd 1.1 x 1: 1 -0.85,0; 2 0.85,0
DPAK = smd 1.6 x 3: 1 -2.28,-5.31; 3 2.28,-5.31 | smd 4.826 x 5.715: 4 0,1.588
0603-RES = smd 1.1 x 1: 1 -0.85,0; 2 0.85,0
KMR2 = smd 1 x 1: 1 2,0.8; 2 2,-0.8; 3 -2,0.8; 4 -2,-0.8
W5500 = smd 1.5 x 0.3: 1 -4.45,2.75; 2 -4.45,2.25; 3 -4.45,1.75; 4 -4.45,1.25; 5 -4.45,0.75; 6 -4.45,0.25; 7 -4.45,-0.25; 8 -4.45,-0.75; 9 -4.45,-1.25; 10 -4.45,-1.75; 11 -4.45,-2.25; 12 -4.45,-2.75; 25 4.45,-2.75; 26 4.45,-2.25; 27 4.45,-1.75; 28 4.45,-1.25; 29 4.45,-0.75; 30 4.45,-0.25; 31 4.45,0.25; 32 4.45,0.75; 33 4.45,1.25; 34 4.45,1.75; 35 4.45,2.25; 36 4.45,2.75 | smd 0.3 x 1.5: 13 -2.75,-4.45; 14 -2.25,-4.45; 15 -1.75,-4.45; 16 -1.25,-4.45; 17 -0.75,-4.45; 18 -0.25,-4.45; 19 0.25,-4.45; 20 0.75,-4.45; 21 1.25,-4.45; 22 1.75,-4.45; 23 2.25,-4.45; 24 2.75,-4.45; 37 2.75,4.45; 38 2.25,4.45; 39 1.75,4.45; 40 1.25,4.45; 41 0.75,4.45; 42 0.25,4.45; 43 -0.25,4.45; 44 -0.75,4.45; 45 -1.25,4.45; 46 -1.75,4.45; 47 -2.25,4.45; 48 -2.75,4.45
QFN-16 = smd 0.8 x 0.3: P1 -1.45,0.75; P2 -1.45,0.25; P3 -1.45,-0.25; P4 -1.45,-0.75; P9 1.45,-0.75; P10 1.45,-0.25; P11 1.45,0.25; P12 1.45,0.75 | smd 0.3 x 0.8: P5 -0.75,-1.45; P6 -0.25,-1.45; P7 0.25,-1.45; P8 0.75,-1.45; P13 0.75,1.45; P14 0.25,1.45; P15 -0.25,1.45; P16 -0.75,1.45 | smd 1.7 x 1.7: PAD 0,0
HANRUN_HR971169C = drill 1.6 pad 2.184: M1 8,-3.05; M2 -8,-3.05 | drill 0.9 pad 1.3: P1 -5.715,-6.35; P2 -4.445,-8.89; P3 -3.175,-6.35; P4 -1.905,-8.89; P5 -0.635,-6.35; P7 1.905,-6.35; P8 3.175,-8.89; P9 4.445,-6.35; P10 5.715,-8.89 | drill 1 pad 1.422: P11 -5.465,-13.72; P12 -2.925,-13.72; P13 2.925,-13.72; P14 5.465,-13.72 | hole 3.23: -5.715,0; 5.715,0
RESONATOR-SMD = smd 0.7 x 1.7: 1 -1.2,0; 2 0,0; 3 1.2,0

### Placement (x,y rotation side)
25MHZ  36.25,22.11 270 top
C1  14.29,41.91 0 top
C3  40.78,40.3 0 top
C4  12.38,11.11 90 top
C9  27.69,34.65 180 top
C10  27.69,36.38 180 top
C11  24.78,39.53 270 top
C12  17.78,12.06 180 top
C13  17.78,10.16 180 top
C14  10.48,1.91 0 top
C21  24.94,19.34 270 top
C22  23.17,19.34 90 top
C23  32.03,22.07 270 top
C24  30.53,22.08 270 top
C25  27.69,38.11 180 top
C33  23.03,39.53 270 top
C35  38.69,22.07 270 top
C36  33.72,22.07 270 top
C37  27.7,29.48 180 top
C38  27.7,22.58 180 top
C39  27.72,27.76 180 top
C40  27.69,20.51 0 top
D1  49.53,35.24 180 top
D2  49.53,26.99 180 top
D3  49.53,18.73 180 top
D4  49.53,10.48 180 top
D5  42.39,14.6 270 top
D6  14.54,10.33 90 top
D7  10.05,12.05 90 top
D8  56.72,23.03 180 top
D9  56.78,13.87 180 top
D10  56.78,4.34 180 top
D11  56.78,32.08 180 top
H1  66.16,41.28 0 top
H2  4.13,4 270 top
H3  4.13,41.28 0 top
H4  66.16,4 0 top
IC2  35.16,13.25 270 top
J1  45.24,35.24 0 top
J2  66.04,33.34 270 top
J3  66.04,26.35 270 top
J4  66.04,19.37 270 top
J5  66.04,12.38 270 top
J6  1.91,12.06 270 top
J7  34.93,3.33 0 top
J8  45.24,26.99 0 top
J9  45.24,18.73 0 top
J10  45.24,10.48 0 top
J11  27.62,9.37 270 top
J12  22.54,9.37 270 top
J13  25.08,9.37 270 top
L1  16.67,4.13 0 top
L2  27.69,39.87 0 top
Q1  57.79,36.51 270 top
Q3  57.79,27.62 270 top
Q5  57.79,18.42 270 top
Q6  57.79,9.21 270 top
R1  21.28,19.34 90 top
R2  21.18,39.5 270 top
R3  41.82,22.12 90 top
R4  7.01,18.56 180 top
R5  8.28,16.8 180 top
R6  48.9,13.65 0 top
R7  40.29,22.12 270 top
R8  41.1,38.73 0 top
R9  48.9,21.91 0 top
R10  48.9,30.16 0 top
R11  48.9,38.42 0 top
R12  32.32,39.94 180 top
R15  47.62,35.24 270 top
R16  47.62,26.99 270 top
R17  47.62,18.73 270 top
R18  47.62,10.48 270 top
R19  27.69,32.92 0 top
R20  27.69,31.21 0 top
R21  27.71,24.3 0 top
R22  27.71,26.03 0 top
R23  42.39,12.7 0 top
SW1  41.91,3.65 270 top
U4  36.72,32.38 315 top
U$15  [HEEPLOGOSMALL]  42.86,-0.32 0 top
U$19  10.64,6.03 270 top
X2  11.11,29.53 90 top
Y4  36.42,7.57 180 top

### Tracks (layer width: path | path; a pad name or v marks a point on that pad's centre or on a via)
13
  Top 0.254: IC2.32 40.69,15.25 D5.A
+3V3  (via drill 0.35)
  Top 0.254: R2.1 23,40.35 C33.1 C11.1 | C11.1 | C11.1 26.33,40.38 L2.1 27.92,40.96 35.56,40.96 | C24.1 v30.54,22.92 | R7.1 R3.2 | U4.28 37,30.34 37,39.51 35.56,40.96 | 35.56,40.96 39.27,40.96 C3.1 | U$19.P5 9.12,6.71 8.76,6.71 8.51,6.46 8.51,1.65 9.53,0.64 17.3,0.64 18.41,1.75 18.27,1.89 L1.P$2 | R7.1 40.29,23.79 v39.95,24.13 | R7.1 39.47,22.16 39.47,20.56 37.66,18.75 37.66,16.91 | IC2.34 37.66,16.91 | IC2.33 | IC2.33 38.64,15.94 37.66,16.91 | v39.54,11.9 39.32,11.67 39.32,11.51 39.06,11.25 IC2.24 | v39.36,16.05 39.07,15.76 IC2.33 | IC2.44 30.48,16.73 v30.21,16.46 | v30.74,13.72 30.74,13.55 30.7,13.51 | IC2.14 33.66,9.29 v34.05,8.9 | v31.11,9.9 30.83,10.02 29.78,10.02 28.7,11.1 v28.7,13.89
  Top 0.305: IC2.6 30.96,13.25 30.7,13.51 27.9,16.31 21.24,16.31 v21.11,16.19
  Top 0.35: 39.7,27.65 U4.28
  Top 0.406: v39.7,27.31 39.7,27.65
  Top 0.813: J12.4 J12.3 | J12.3 J12.2 J12.1 21.75,10.16 C13.1 C12.1 | L1.P$2 22.38,4.13 J12.3 | v30.54,22.92 C23.1 32.66,23.55 32.66,23.71 33.16,24.2 34.06,24.2 34.31,24.45 v34.45,24.45
  Bottom 0.254: v39.95,24.13 39.1,24.98 39.1,25.47 | v39.54,11.9 39.54,15.86 v39.36,16.05 | v30.21,16.46 30.74,15.93 v30.74,13.72 30.57,13.89 v28.7,13.89 | v34.05,8.9 33.05,9.9 v31.11,9.9
  Bottom 0.305: v21.11,16.19
  Bottom 0.813: C12.1 18.53,15.74 R1.1 | J12.1 22.54,10 19.68,12.86 19.68,14.76 v21.11,16.19 24.54,19.62 27.21,19.62 30.5,22.92 v30.54,22.92 | v34.45,24.45 35.47,25.47 39.1,25.47 39.62,25.99 39.62,27.24 v39.7,27.31
  other vias: 18.53,12.06 21.28,18.49
A0  (via drill 0.35)
  Top 0.254: J13.4 26.37,3.03 26.37,11.1 v27.01,11.74 | IC2.36 36.66,17.53 v36.73,17.59
  Bottom 0.254: v36.73,17.59 30.1,17.59 27.01,14.5 v27.01,11.74
A1  (via drill 0.35)
  Top 0.254: IC2.37 36.16,17.3 36.12,17.34 36.12,18.12 v36.19,18.2
  Bottom 0.254: v36.19,18.2 29.76,18.2 27.15,15.59 | 27.15,15.59 26.79,15.22 | 27.15,15.59 27.15,15.5 26.4,14.75 26.4,5.61 J13.3
A2  (via drill 0.35)
  Top 0.254: IC2.38 35.66,17.87 35.58,17.95 35.58,18.45 35.66,18.52 v35.66,18.8
  Bottom 0.254: v35.66,18.8 35.46,18.6 29.59,18.6 26,15.01 26,13.45 23.86,11.32 23.86,8.05 J13.2
A3  (via drill 0.35)
  Top 0.254: J13.1 25.08,13.28 v24.18,14.18 | v34.8,19.22 34.8,17.95 35.16,17.6 IC2.39
  Bottom 0.254: v24.18,14.18 29.22,19.22 v34.8,19.22
ACTLED  (via drill 0.35)
  Top 0.254: v33.02,25.08 33.97,25.08 37.47,28.57 38.06,28.57 U4.27
  Bottom 0.254: X2.P11 25.85,25.08 v33.02,25.08
D+
  Top 0.254: R5.1 28.03,16.8 30.48,14.35 31.59,14.35 IC2.4
D-
  Top 0.254: R4.1 8.84,17.57 9.79,17.57 9.9,17.46 27.94,17.46 30.65,14.75 IC2.3
DRAIN1
  Top 1.27: D11.A 59.36,36.51 Q1.4
  Top 2.54: Q1.4 60.85,35.04 J2.2
DRAIN2
  Top 1.27: D8.A 59.37,27.54 Q3.4
  Top 2.54: Q3.4 59.8,28.05 J3.2
DRAIN3
  Top 1.27: D9.A 57.79,16.72 57.79,18.42 Q5.4
  Top 2.54: Q5.4 62.02,21.07 J4.2
DRAIN4
  Top 1.27: D10.A 59.37,8.79 Q6.4
  Top 2.54: Q6.4 64.25,14.08 J5.2
EN1  (via drill 0.35)
  Top 0.254: Q1.1 51.58,38.42 R11.2 49.75,36.51 D1.A 48.48,35.24 J1.1 | IC2.31 40.12,14.75 v40.23,14.65 | v42.72,20.07 43.59,20.94 v46.48,20.94
  Bottom 0.254: v40.23,14.65 42.72,17.13 v42.72,20.07 | v46.48,20.94 46.48,34.01 J1.1
EN2  (via drill 0.35)
  Top 0.254: J8.1 45.26,27.01 48.24,27.01 48.86,27.62 49.12,27.62 D2.A 49.75,28.25 R10.2 51.58,30.16 Q3.1 | IC2.30 39.77,14.25 v40.19,13.83
  Bottom 0.254: v40.19,13.83 40.4,14.04 40.48,14.04 43.44,16.99 43.44,20.52 45.24,22.33 J8.1
EN3  (via drill 0.35)
  Top 0.254: J9.1 48.48,18.73 D3.A 49.75,20 R9.2 50.64,21.01 Q5.1 | IC2.29 39.41,13.75 v40.36,12.8
  Bottom 0.254: v40.36,12.8 45.24,17.69 J9.1
EN4
  Top 0.254: Q6.1 50.64,12.76 R6.2 49.75,11.74 D4.A 49.31,11.53 48.24,10.46 45.26,10.46 J10.1 45.23,10.49 41.81,10.49 39.55,12.75 IC2.27
GND  (via drill 0.35)
  Top 0.254: U$19.P4 9.89,6.78 v10.16,6.51 | J6.P2 4.32,8.36 J6.P4 | R12.1 35.15,39.94 v35.24,39.85 | IC2.5 34.66,13.75 IC2.THERMAL | IC2.43 33.26,16.63 33.26,16.21 35.16,14.31 IC2.THERMAL | IC2.35 37.16,15.25 IC2.THERMAL | IC2.23 37.66,10.75 IC2.THERMAL | IC2.15 34.26,9.87 34.26,10.29 35.16,11.2 IC2.THERMAL
  Top 0.305: v11.11,5.56 11.34,5.78 U$19.P14 U$19.P15 | U$19.PAD 11.84,6.03 U$19.P15 | U$19.P15 11.34,6.28 v11.11,6.51
  Bottom 0.254: v35.24,39.85 35.4,39.69 v38.1,39.69
  other vias: 10.16,5.56
  pour Top (rank 2): -4.29,46.67 14.61,46.67 14.61,40.32 56.04,40.32 55.88,-4.45 -4.45,-4.45
  pour Bottom (rank 2): -4.29,46.67 14.61,46.67 14.61,40.32 56.04,40.32 55.88,-4.45 -4.45,-4.45
INT  (via drill 0.35)
  Top 0.254: R3.1 43.44,22.89 v44.05,22.89 | v43.52,30.81 42.18,30.81 U4.36
  Bottom 0.254: v44.05,22.89 44.05,26.46 44.02,26.48 44.02,27.49 44.17,27.64 44.17,30.16 v43.52,30.81
LNKLED  (via drill 0.35)
  Top 0.254: v38.73,26.35 37.93,27.16 U4.25
  Bottom 0.254: v38.73,26.35 32.77,32.32 24.97,32.32 X2.P13
MISO  (via drill 0.35)
  Top 0.254: IC2.11 30.16,10.75 v30.03,10.63 | U4.34 42.31,29.28 42.37,29.28 43.44,28.21 v43.44,27.86 | v31.61,8.78 31.61,5.55 31.17,5.11 31.17,3.28 J7.1
  Bottom 0.254: v43.44,27.86 43.44,21.72 32.88,11.17 30.57,11.17 v30.03,10.63 30.51,10.15 30.51,9.65 30.86,9.3 31.09,9.3 v31.61,8.78
MOSI  (via drill 0.35)
  Top 0.254: IC2.10 29.71,11.25 v29.59,11.37 | U4.35 41.49,30.83 42.62,29.71 v43.56,29.71
  Bottom 0.254: v43.56,29.71 42.83,28.98 42.83,21.69 32.72,11.57 29.8,11.57 v29.59,11.37 29.59,11.04 29.43,10.88 29.43,10.1 J7.4
N$3  (via drill 0.35)
  Top 0.254: R2.2
  Bottom 0.254: X2.P14 R2.2
  other vias: 21.18,38.64
N$4  (via drill 0.35)
  Bottom 0.254: X2.P12 24.83,25.52 23.8,24.49 23.8,22.71 R1.2
  other vias: 21.28,20.19
N$5
  Top 0.254: R15.2 47.83,34.19 D1.C
N$6  (via drill 0.35)
  Top 0.254: J6.3 6.99,12.07 v7.3,12.38
  Bottom 0.254: v7.3,12.38 7.3,16.19 7.62,16.51 7.43,16.7 R5.2
  other vias: 7.43,16.8
N$7
  Top 0.254: R16.2 49.33,26.14 D2.C
N$8
  Top 0.254: R17.2 49.33,17.88 D3.C
N$9
  Top 0.254: R18.2 49.33,9.63 D4.C
N$10
  Top 0.254: R23.2 43.24,14.41 D5.C
N$11
  Top 0.254: IC2.16 34.66,8.99 35.24,8.41 35.24,7.59 Y4.3
N$12
  Top 0.254: Y4.1 37.05,8.14 37.05,8.54 36.54,9.05 35.4,9.05 35.16,9.29 IC2.17
N$13  (via drill 0.35)
  Top 0.254: J6.2 6.02,12.72 v6.03,12.7
  Bottom 0.254: v6.03,12.7 6.16,12.83 R4.2
  other vias: 6.16,18.56
N$14
  Top 0.254: U$19.P10 10.39,4.04 9.68,3.33 9.68,1.95 C14.1
N$16
  Top 0.254: C14.2 11.23,2.81 11.75,3.33 11.75,4.22 U$19.P12 U$19.P13
  Top 0.305: D6.C 12.38,8.48 U$19.P1 U$19.P16 14.33,6.78 15.08,6.03 15.07,6.02 L1.P$1 13.24,4.13 U$19.P13
N$18
  Top 0.254: C21.1 26.01,21.26 26.01,21.44 26.37,21.8 27.51,21.8 27.72,22 27.72,28.4 27.9,28.57 29.89,28.57 30.18,28.29 30.38,28.29 30.52,28.15 33.55,28.15 U4.20
N$19
  Top 0.254: C22.1 24.04,19.36 25.56,19.36 25.93,19.73 27.51,19.73 27.67,19.89 27.67,21.39 28.81,21.39 29.75,22.33 29.75,23.6 31.75,25.6 31.75,26.35 32.1,26.7 32.64,26.7 32.8,26.86 33.68,26.86 U4.22
N$20
  Top 0.254: U4.10 30.48,36.15 30.48,39.37 31.05,39.94 R12.2
N$23  (via drill 0.35)
  Top 0.254: R22.1 R21.1
  Bottom 0.254: R21.1 26.86,20.85 C40.1
  other vias: 26.86,24.3 26.84,20.51
N$25
  Top 0.254: C35.1 39.08,23.32 | U4.31 40.05,29.38 40.71,28.72 40.71,26.89 38.69,24.87 C35.1 | 25MHZ.3 37.47,21.28 37.47,21.91 38.48,22.92 C35.1
N$26
  Top 0.254: C36.1 34.08,23.28 35.24,23.28 | 35.24,23.28 25MHZ.1 | U4.30 40.2,28.55 40.3,28.55 40.3,27.06 38.99,25.75 35.59,25.75 35.24,25.4 35.24,23.28
RD+
  Top 0.254: X2.P4 23.18,24.45 23.18,23.49 24.09,22.58 C38.2
RD-
  Top 0.254: X2.P5 24.76,28.89 26.04,27.62 26.73,27.62 C39.2
RDN  (via drill 0.35)
  Top 0.254: R22.2 C39.1 | C39.1 28.75,27.94 | U4.5 34.11,36.09 33.55,36.66 33.55,37.06 v33.19,37.41 | v29.56,30.2 29.56,30.33 30.18,30.95 30.18,33.04 v30.48,33.34 | C39.1 29.34,27.76 v29.53,27.94
  Bottom 0.254: v30.48,33.34 30.48,36.51 31.14,37.18 32.64,37.18 32.88,37.41 v33.19,37.41 | v29.53,27.94 29.56,27.98 v29.56,30.2
RDP  (via drill 0.35)
  Top 0.254: C38.1 28.56,22.59 R21.2 30.26,26 v30.26,27.53 | U4.6 33.65,35.71 33.09,36.27 32.31,36.27 v32.07,36.51 | v30.48,29.53 30.48,30.67 30.59,30.78 30.59,32.39 31.13,32.93 v31.21,32.93
  Bottom 0.254: v32.07,36.51 31.21,35.65 v31.21,32.93 | v30.26,27.53 30.26,29.3 v30.48,29.53
RST  (via drill 0.35)
  Top 0.254: J7.5 40.7,2.06 SW1.2 SW1.4 | v33.17,8.54 33.17,9.77 IC2.13
  Bottom 0.254: J7.5 36.14,3.38 36.14,5.11 33.17,8.08 v33.17,8.54
SCK  (via drill 0.35)
  Top 0.254: v29.44,13.19 29.48,13.15 29.48,12.33 30.06,11.75 IC2.9 | v42.12,28.67 40.75,30.04 U4.33
  Bottom 0.254: v42.12,28.67 42.12,21.55 32.55,11.98 29.84,11.98 29.48,12.33 29.48,13.15 v29.44,13.19 29.44,12.07 28.99,11.62 28.99,8 29.44,7.55 29.44,5.82 31.88,3.38 33.6,3.38 J7.3
SCSN_WIZ  (via drill 0.35)
  Top 0.254: IC2.8 30.42,12.25 v30.09,12.59 | U4.32 41.2,28.97 v41.2,24.3
  Bottom 0.254: v30.09,12.59 32.58,12.59 37.33,17.34 37.33,18.32 R7.2 41.2,22.19 v41.2,24.3
  other vias: 40.29,21.27
TDN  (via drill 0.35)
  Top 0.254: v23.48,31.2 v26.83,31.2 R20.1 | U4.1 35.45,37.48 34.22,38.71 33.63,38.71 32.7,37.78 v32.39,37.78 | v29.84,33.97 29.57,33.7 v29.57,31.2
  Bottom 0.254: X2.P3 19.02,27.91 19.02,28.03 22.2,31.21 v23.48,31.2 | v26.83,31.2 v29.57,31.2 29.61,31.2 | v29.84,33.97 29.84,37.15 30.48,37.78 v32.39,37.78
TDP  (via drill 0.35)
  Top 0.254: v33.97,38.1 34.19,38.1 U4.2
  Bottom 0.254: X2.P1 17.46,24.96 16.48,25.95 16.48,26.76 17.05,27.34 17.49,27.34 23.81,33.65 26.11,33.65 R19.1 26.84,35.73 29.53,38.42 33.66,38.42 v33.97,38.1
  other vias: 26.84,32.92
VBAT  (via drill 0.35, 0.65)
  Top 0.305: U$19.P11 10.93,4.54 10.93,4.14 10.95,4.12 v10.95,3.49 | 10.39,7.98 U$19.P3 U$19.P2 | 10.39,7.98 10.39,8.25 | 10.39,8.25 10.39,8.41 | 10.39,8.41 10.39,8.73 | 10.39,8.73 10.39,9.05 | 10.39,9.05 10.39,9.86 D7.C 10.68,9.57 | U$19.P2 10.89,7.94 | 10.89,7.94 10.89,8.5 | 10.89,8.5 10.89,8.73 | 10.89,8.73 10.89,9.05 | 10.89,9.05 10.89,9.36 10.68,9.57 | U$19.P2 10.39,7.98 | 10.89,7.94 10.7,7.94 10.51,8.13 | 10.51,8.13 10.39,8.25 | 10.51,8.13 10.89,8.5 | 10.39,8.41 10.7,8.73 10.89,8.73 | 10.39,8.73 10.7,9.05 10.89,9.05 | 10.39,9.05 10.68,9.34 10.68,9.57
  Top 0.406: 12.38,10.16 C4.1 12,9.98
  Top 1.016: 12.38,10.16 12.34,10.2 D7.C 8.29,10.2 v8.26,10.16
  Bottom 0.305: v10.95,3.49 9.68,3.49 8.41,4.76 8.41,8.57 D7.C
  Bottom 1.016: v8.26,10.16 8.26,11.94 8.42,12.1 8.42,28.1 16.51,36.2 19.05,36.2 X2.P10
  Bottom 1.27: X2.P8 X2.P10 | 16.51,36.2 16.51,41.48 C1.+
  other vias: 16.94,41.91 10.05,10.2
  pour Top: 14.76,47.94 74.61,47.94 74.61,-5.24 56.52,-5.24 56.52,40.96 21.59,40.96 21.59,31.68 18.96,31.68 18.96,35.24 14.76,38.42
  pour Bottom: 14.76,47.94 74.61,47.94 74.61,-5.24 56.52,-5.24 56.52,40.96 21.59,40.96 21.59,31.68 18.96,31.68 18.96,35.24 14.76,38.42
VBUS
  Top 0.254: J7.2 32.39,9.14 32.26,9.26 32.26,10.29 32.37,10.4 32.37,12.49 32.2,12.66 31.78,12.66 IC2.7
  Top 0.305: J6.1 9.51,13.36 D7.A 11.7,15.56 21.38,15.56 21.68,15.86 27.71,15.86 30.77,12.8 31.64,12.8 IC2.7
VCCA  (via drill 0.35)
  Top 0.254: C9.1 R19.2 R20.2 C37.1 29.02,29.01 29.97,29.01 30.29,28.89 v31.43,28.89 31.75,29.21 32.15,29.21 | C9.1 C10.1 | C10.1 | C10.1 C25.1 L2.2 | C9.1 31.28,34.65 U4.11 32.09,33.94 32.65,33.38 32.88,33.38 33.61,34.11 | 33.61,34.11 33.61,34.24 33.66,34.29 33.61,34.34 33.05,34.9 U4.8 | U4.4 34.46,36.32 35.02,35.75 35.02,35.52 33.61,34.11 | U4.15 32.34,30.38 31.78,29.81 31.78,29.58 32.15,29.21 | 32.15,29.21 32.39,29.21 32.95,29.77 U4.17 | U4.21 33.41,27.3 v32.39,27.3
  Bottom 0.254: v32.39,27.3 32.39,27.94 v31.43,28.89
WIZ_RST  (via drill 0.35)
  Top 0.254: U4.37 42.7,34.48 v42.7,35.08 45.7,32.08 v47.33,32.08 | IC2.22 37.91,9.53 v37.91,9.11
  Bottom 0.254: v42.7,35.08 42.7,36.28 R8.1 | v47.33,32.08 47.09,31.84 47.09,18.29 v37.91,9.11 37.91,9.5
  other vias: 40.25,38.73

### Text on the board
tPlace: Maglock / Rev-D | + - | 1 | 2 | 3 | A3-A0 | 3v3 | GND | 13 | 4 | RST | + -
Document: + | + | + | + | + | +
tDocu: A5 | A4 | A3 | A2 | A1 | A0 | 9 | 10 | 11 | 12 | 13 | 0 | 1 | 2 | 3 | 4 | 5 | 6 | 7 | 8